# Altium schematic sheet MCU.SchDoc
size Letter; Organization: Cegep Limoilou; Address1: 1300, 8e Avenue; Address2: Québec, QC; Address3: Canada; Address4: G1J 5L5; Revision: Enseignants; SheetNumber: 7; SheetTotal: 8; Conception: Ilyes Gharmoul; Titre: MCU; Modification: Ilyes G
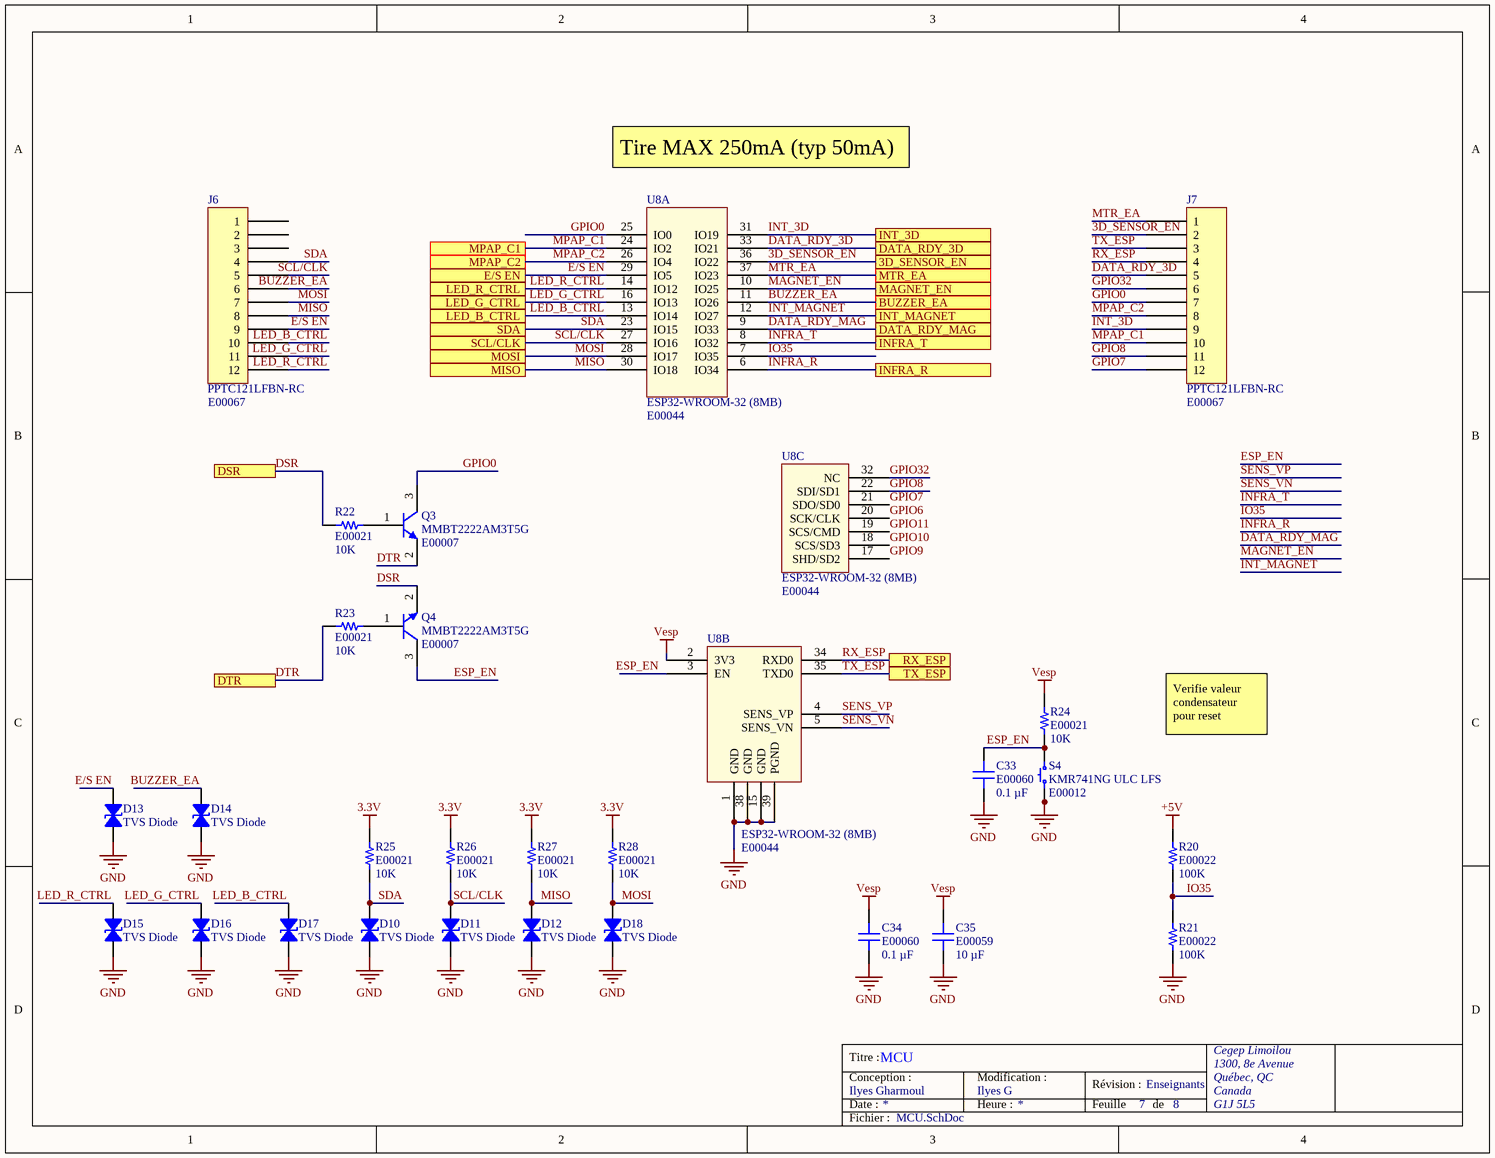
[diagram p0: MCU.SchDoc]

## Parts
C33  ADAM Inventory Number 1: E00060  [CAP 0603]  (hidden comment: 0.1 µF)
C34  ADAM Inventory Number 1: E00060  [CAP 0603]  (hidden comment: 0.1 µF)
C35  ADAM Inventory Number 1: E00059  [CAP 0603]  (hidden comment: 10 µF)
D10  TVS Diode  [TVS DIODE]
D11  TVS Diode  [TVS DIODE]
D12  TVS Diode  [TVS DIODE]
D13  TVS Diode  [TVS DIODE]
D14  TVS Diode  [TVS DIODE]
D15  TVS Diode  [TVS DIODE]
D16  TVS Diode  [TVS DIODE]
D17  TVS Diode  [TVS DIODE]
D18  TVS Diode  [TVS DIODE]
J6  PPTC121LFBN-RC  ADAM Inventory Number 1: E00067  [CONN 12PIN FEMALE]
J7  PPTC121LFBN-RC  ADAM Inventory Number 1: E00067  [CONN 12PIN FEMALE]
Q3  MMBT2222AM3T5G  ADAM Inventory Number 1: E00007  [SOT-723]
Q4  MMBT2222AM3T5G  ADAM Inventory Number 1: E00007  [SOT-723]
R20  ADAM Inventory Number 1: E00022  [RES 0603]  (hidden comment: 100K)
R21  ADAM Inventory Number 1: E00022  [RES 0603]  (hidden comment: 100K)
R22  ADAM Inventory Number 1: E00021  [RES 0603]  (hidden comment: 10K)
R23  ADAM Inventory Number 1: E00021  [RES 0603]  (hidden comment: 10K)
R24  ADAM Inventory Number 1: E00021  [RES 0603]  (hidden comment: 10K)
R25  ADAM Inventory Number 1: E00021  [RES 0603]  (hidden comment: 10K)
R26  ADAM Inventory Number 1: E00021  [RES 0603]  (hidden comment: 10K)
R27  ADAM Inventory Number 1: E00021  [RES 0603]  (hidden comment: 10K)
R28  ADAM Inventory Number 1: E00021  [RES 0603]  (hidden comment: 10K)
S4  KMR741NG ULC LFS  ADAM Inventory Number 1: E00012  [Switch Lin SMD]
U8  ESP32-WROOM-32 (8MB)  ADAM Inventory Number 1: E00044  [ESP32-WROOM-32D]  (parts A,B,C of 3)

## Ports
3D_SENSOR_EN, BUZZER_EA, DATA_RDY_3D, DATA_RDY_MAG, DSR, DTR, E/S EN, INFRA_R, INFRA_T, INT_3D, INT_MAGNET, LED_B_CTRL, LED_G_CTRL, LED_R_CTRL, MAGNET_EN, MISO, MOSI, MPAP_C1, MPAP_C2, MTR_EA, RX_ESP, SCL/CLK, SDA, TX_ESP

## Nets
3.3V: R25.2 R26.2 R27.2 R28.2
+5V: R20.2
GND: C33.1 C34.1 C35.1 D10.1 D11.1 D12.1 D13.1 D14.1 D15.1 D16.1 D17.1 D18.1 R21.1 S4.1 S4.2 U8.1(GND) U8.15(GND) U8.38(GND) U8.39(PGND)
Vesp: C34.2 C35.2 R24.2 U8.2(3V3)
3D_SENSOR_EN: J7.2 U8.36(IO22) ; port 3D_SENSOR_EN
BUZZER_EA: D14.2 J6.6 U8.11(IO26) ; port BUZZER_EA
DATA_RDY_3D: J7.5 U8.33(IO21) ; port DATA_RDY_3D
DATA_RDY_MAG: U8.9(IO33) ; port DATA_RDY_MAG
DSR: Q4.2(E) R22.2 ; port DSR
DTR: Q3.2(E) R23.2 ; port DTR
E/S EN: D13.2 J6.9 U8.29(IO5) ; port E/S EN
ESP_EN: C33.2 Q4.3(C) R24.1 S4.3 S4.4 U8.3(EN)
GPIO0: J7.7 Q3.3(C) U8.25(IO0)
GPIO6: U8.20(SCK/CLK)
GPIO7: J7.12 U8.21(SDO/SD0)
GPIO8: J7.11 U8.22(SDI/SD1)
GPIO9: U8.17(SHD/SD2)
GPIO10: U8.18(SCS/SD3)
GPIO11: U8.19(SCS/CMD)
GPIO32: J7.6 U8.32(NC)
INFRA_R: U8.6(IO34) ; port INFRA_R
INFRA_T: U8.8(IO32) ; port INFRA_T
INT_3D: J7.9 U8.31(IO19) ; port INT_3D
INT_MAGNET: U8.12(IO27) ; port INT_MAGNET
IO35: R20.1 R21.2 U8.7(IO35)
LED_B_CTRL: D17.2 J6.10 U8.13(IO14) ; port LED_B_CTRL
LED_G_CTRL: D16.2 J6.11 U8.16(IO13) ; port LED_G_CTRL
LED_R_CTRL: D15.2 J6.12 U8.14(IO12) ; port LED_R_CTRL
MAGNET_EN: U8.10(IO25) ; port MAGNET_EN
MISO: D12.2 J6.8 R27.1 U8.30(IO18) ; port MISO
MOSI: D18.2 J6.7 R28.1 U8.28(IO17) ; port MOSI
MPAP_C1: J7.10 U8.24(IO2) ; port MPAP_C1
MPAP_C2: J7.8 U8.26(IO4) ; port MPAP_C2
MTR_EA: J7.1 U8.37(IO23) ; port MTR_EA
RX_ESP: J7.4 U8.34(RXD0) ; port RX_ESP
SCL/CLK: D11.2 J6.5 R26.1 U8.27(IO16) ; port SCL/CLK
SDA: D10.2 J6.4 R25.1 U8.23(IO15) ; port SDA
SENS_VN: U8.5(SENS_VN)
SENS_VP: U8.4(SENS_VP)
TX_ESP: J7.3 U8.35(TXD0) ; port TX_ESP
NetQ3_1: Q3.1(B) R22.1
NetQ4_1: Q4.1(B) R23.1

Not connected (* = marked no-connect by the designer): J6 1 2 3

## Notes on the sheet
- Tire MAX 250mA (typ 50mA)
- Verifie valeur condensateur pour reset
- Titre :
- Conception :
- Date :
- Modification :
- Heure :
- Révision :
- Feuille
- de
- Fichier :

## Library data of the parts
C33 C34 = CAP CER 0.1UF 50V X7R 0603: Manufacturer Part Number 1: C0603C104K5RAC7411; manufacturer: KEMET; Tolerance: ±10%; Applications: Bypass, Decoupling; Capacitance: 0.1 µF; componentlink1description: Datasheet; componentlink1url: https://api.kemet.com/component-edge/download/datasheet/C0603C104K5RAC7411.pdf; componentlink2description: DigiKey Link; componentlink2url: https://www.digikey.com/en/products/detail/kemet/C0603C104K5RAC7411/3317013; Device Package: 0603 (1608 Metric); lastupdated: 2023-03-28 19:09:05; Lifecycle Status: Active; Minimum Order: 1; Mounting Type: Surface Mount, MLCC; Operating Temperature: -55°C ~ 125°C; Package / Case: 0603 (1608 Metric); packaging: TapeAndReel; partid: 2233; Part Status: Active; price: 0.01; series: SMD Comm X7R; Size / Dimension: 0.063" L x 0.031" W (1.60mm x 0.80mm); Supplier 1: DigiKey; Supplier Part Number 1: 399-C0603C104K5RAC7411CT-ND; Temperature Coefficient: X7R; Thickness (Max): 0.035" (0.90mm); Voltage - Rated: 50V; Value: 0.1 µF
C35 = CAP CER 10UF 6.3V: CAP CER 10UF 6.3V X5R 0603; manufacturer: Murata Electronics; Manufacturer Part Number 1: GRM188R60J106ME47D; Tolerance: ±20%; Applications: General Purpose; Capacitance: 10 µF; componentlink1description: Datasheet; componentlink1url: https://www.murata.com/~/media/webrenewal/support/library/catalog/products/capacitor/mlcc/c02e.ashx?la=en-us; componentlink2description: DigiKey Link; componentlink2url: https://www.digikey.com/en/products/detail/murata-electronics/GRM188R60J106ME47D/965910; Device Package: 0603 (1608 Metric); lastupdated: 2023-03-30 19:09:15; Lifecycle Status: Active; Minimum Order: 1; Mounting Type: Surface Mount, MLCC; Operating Temperature: -55°C ~ 85°C; Package / Case: 0603 (1608 Metric); packaging: TapeAndReel; partid: 2351; Part Status: Active; price: 0.02; series: GRM; Size / Dimension: 0.063" L x 0.031" W (1.60mm x 0.80mm); Supplier 1: DigiKey; Supplier Part Number 1: 490-3896-1-ND; Temperature Coefficient: X5R; Thickness (Max): 0.035" (0.90mm); Voltage - Rated: 6.3V; Value: 10 µF
D10-D18 = TVS Diode: TVS DIODE 30.8V 49.9V DO214AC; Manufacturer Part Number 1: P4SMA36CA R3G; Manufacturer: Taiwan Semiconductor Corporation; Bidirectional Channels: 1; Current - Peak Pulse (10/1000µs): 8.4A; Power Line Protection: No; Power - Peak Pulse: 400W; Type: Zener; Voltage - Breakdown (Min): 34.2V; Applications: General Purpose; ComponentLink1Description: Datasheet; ComponentLink1URL: https://www.taiwansemi.com/products/datasheet/P4SMA%20SERIES_Q1705.pdf; ComponentLink2Description: DigiKey Link; ComponentLink2URL: http://digikey.com/product-detail/en/taiwan-semiconductor-corporation/P4SMA36CA-R3G/P4SMA36CAR3GCT-ND/7357928; LastUpdated: 2023-04-16 20:19:58; Lifecycle Status: Active; Minimum Order: 1; Mounting Type: Surface Mount; Operating Temperature: -55°C ~ 150°C (TJ); Package / Case: DO-214AC, SMA; Packaging: TapeAndReel; PartId: 7281; Part Status: Active; Price: 0.11; Series: P4SMA; Supplier 1: DigiKey; Supplier Part Number 1: P4SMA36CAR3GCT-ND; Supplier Device Package: DO-214AC (SMA); Voltage - Clamping (Max) @ Ipp: 49.9V; Voltage - Reverse Standoff (Typ): 30.8V
J6 J7 = 12PO FEM HEADER: CONN RCPT 12POS 0.1 GOLD PCB; Manufacturer: Harwin Inc.; Connector Type: Receptacle; Current Rating (Amps): 3A; Mated Stacking Heights: 11.04mm, 12.63mm; Material Flammability Rating: UL94 V-0; Number of Positions: 12; Number of Positions Loaded: All; Style: Board to Board or Cable; ComponentLink1Description: Datasheet; ComponentLink1URL: https://cdn.harwin.com/pdfs/C001XX_M20_Series_Connectors.pdf; ComponentLink2Description: DigiKey Link; ComponentLink2URL: http://digikey.com/product-detail/en/harwin-inc/M20-7821242/952-1852-ND/3727819; Contact Finish - Mating: Gold; Contact Finish - Post: Tin; Contact Finish Thickness - Mating: Flash; Contact Type: Female Socket; Fastening Type: Push-Pull; Insulation Color: Black; LastUpdated: 2022-09-21 18:59:31; Lifecycle Status: Active; Minimum Order: 5004; Mounting Type: Through Hole; Number of Rows: 1; Operating Temperature: -40°C ~ 105°C; Packaging: Tube; Part Status: Active; Price: 0.74; Series: M20; Termination: Solder; Supplier 1: Digi-Key; Supplier Part Number 1: S6100-ND; Manufacturer Part Number 1: PPTC121LFBN-RC
Q3 Q4 = TRANS NPN 40V: TRANS NPN 40V 0.6A SOT-723; Manufacturer: ON Semiconductor; Current - Collector Cutoff (Max): 10nA (ICBO); Current - Collector (Ic) (Max): 600mA; DC Current Gain (hFE) (Min) @ Ic, Vce: 100 @ 150mA, 10V; Frequency - Transition: 300MHz; Power - Max: 640mW; Vce Saturation (Max) @ Ib, Ic: 1V @ 50mA, 500mA; Manufacturer Part Number 1: MMBT2222AM3T5G; ComponentLink1Description: Datasheet; ComponentLink1URL: http://www.onsemi.com/pub/Collateral/MMBT2222AM3-D.PDF; ComponentLink2Description: DigiKey Link; ComponentLink2URL: http://digikey.com/product-detail/en/on-semiconductor/MMBT2222AM3T5G/MMBT2222AM3T5GOSCT-ND/3487571; LastUpdated: 2023-03-28 20:16:11; Lifecycle Status: Active; Minimum Order: 1; Mounting Type: Surface Mount; Operating Temperature: -55°C ~ 150°C (TJ); Package / Case: SOT-723; Packaging: TapeAndReel; PartId: 22; Part Status: Active; Price: 0.03; Series: -; Supplier 1: DigiKey; Supplier Part Number 1: MMBT2222AM3T5GOSCT-ND; Supplier Device Package: SOT-723; Transistor Type: NPN; Voltage - Collector Emitter Breakdown (Max): 40V
R20 R21 = RES SMD 100K OHM: RES SMD 100K OHM 1% 1/4W 0603; Manufacturer Part Number 1: RC0603FR-07100KL; Manufacturer: Vishay Dale; Power (Watts): 0.25W, 1/4W; Temperature Coefficient: ±100ppm/°C; ComponentLink1Description: Datasheet; ComponentLink1URL: http://www.vishay.com/docs/20065/rcse3.pdf; ComponentLink2Description: DigiKey Link; ComponentLink2URL: https://www.digikey.com/en/products/detail/vishay-dale/RCS0603100KFKEA/5866946; Composition: Thick Film; Device Package: 0603 (1608 Metric); Features: Automotive AEC-Q200, Pulse Withstanding; Height - Seated (Max): 0.020" (0.50mm); LastUpdated: 2023-03-27 19:26:49; Lifecycle Status: Active; Minimum Order: 1; Number of Terminations: 2; Operating Temperature: -55°C ~ 155°C; Package / Case: 0603 (1608 Metric); Packaging: TapeAndReel; PartId: 5363; Part Status: Active; Price: 0.02; Ratings: AEC-Q200; Resistance: 100K; Series: RCS e3; Size / Dimension: 0.061" L x 0.033" W (1.55mm x 0.85mm); Supplier Device Package: 0603; Tolerance: ±1%; Supplier 1: Future Electronics; Supplier Part Number 1: 3697448; Value: 100K
R22-R28 = RES SMD 10K OHM: RES SMD 10K OHM 1% 1/10W 0603; Manufacturer Part Number 1: RC0603FR-0710KL; Manufacturer: Rohm Semiconductor; Power (Watts): 0.25W, 1/4W; Temperature Coefficient: ±100ppm/°C; ComponentLink1Description: Datasheet; ComponentLink1URL: https://www.rohm.com/datasheet/ESR01MZPF/esr-e; ComponentLink2Description: DigiKey Link; ComponentLink2URL: https://www.digikey.com/en/products/detail/rohm-semiconductor/ESR03EZPF1002/1983429; Composition: Thick Film; Device Package: 0603 (1608 Metric); Features: Automotive AEC-Q200, Pulse Withstanding; Height - Seated (Max): 0.022" (0.55mm); LastUpdated: 2023-03-27 19:26:49; Lifecycle Status: Active; Minimum Order: 1; Number of Terminations: 2; Operating Temperature: -55°C ~ 155°C; Package / Case: 0603 (1608 Metric); Packaging: TapeAndReel; PartId: 5466; Part Status: Active; Price: 0.02; Ratings: AEC-Q200; Resistance: 10K; Series: ESR; Size / Dimension: 0.063" L x 0.031" W (1.60mm x 0.80mm); Supplier Device Package: 0603; Tolerance: ±1%; Supplier 1: Future Electronics; Supplier Part Number 1: 3349388; Value: 10K
S4 = Sw Lin: SWITCH TACTILE SPST-NO 50MA 32V; Manufacturer: C&K; Actuator Height off PCB, Vertical: 2.50mm; Actuator Orientation: Top Actuated; Actuator Type: Standard; Contact Rating @ Voltage: 0.05A @ 32VDC; Illumination: Non-Illuminated; Ingress Protection: IP67 - Dust Tight, Waterproof; Operating Force: 400gf; Outline: 4.20mm x 2.80mm; Switch Function: Off-Mom; Manufacturer Part Number 1: KMR741NG ULC LFS; Circuit: SPST-NO; ComponentLink1Description: Datasheet; ComponentLink1URL: https://dznh3ojzb2azq.cloudfront.net/products/Tactile/KMR7/documents/datasheet.pdf; ComponentLink2Description: DigiKey Link; ComponentLink2URL: http://digikey.com/product-detail/en/c-k/KMR741NG-ULC-LFS/CKN10688CT-ND/6035360; LastUpdated: 2020-04-09 10:01:05; Lifecycle Status: Active; Minimum Order: 1; Mounting Type: Surface Mount; Operating Temperature: -40°C ~ 85°C; Packaging: TapeAndReel; Part Status: Active; Price: 0.16; Series: KMR7; Supplier 1: DigiKey; Supplier Part Number 1: CKN10688CT-ND; Termination Style: Gull Wing
U8 = ESP32-WROOM-32 (8MB): No Description Available; Mfr_Name: Espressif Systems; Manufacturer Part Number 1: ESP32-WROOM-32D-N4; Copyright: Copyright (C) 2023 Ultra Librarian. All rights reserved.; RefDes: RefDes; Type: DEV; Supplier 1: Digi-Key; Supplier Part Number 1: 1965-ESP32-WROOM-32D-N4TR-ND